# Altium project PCB_Project.PrjPcb
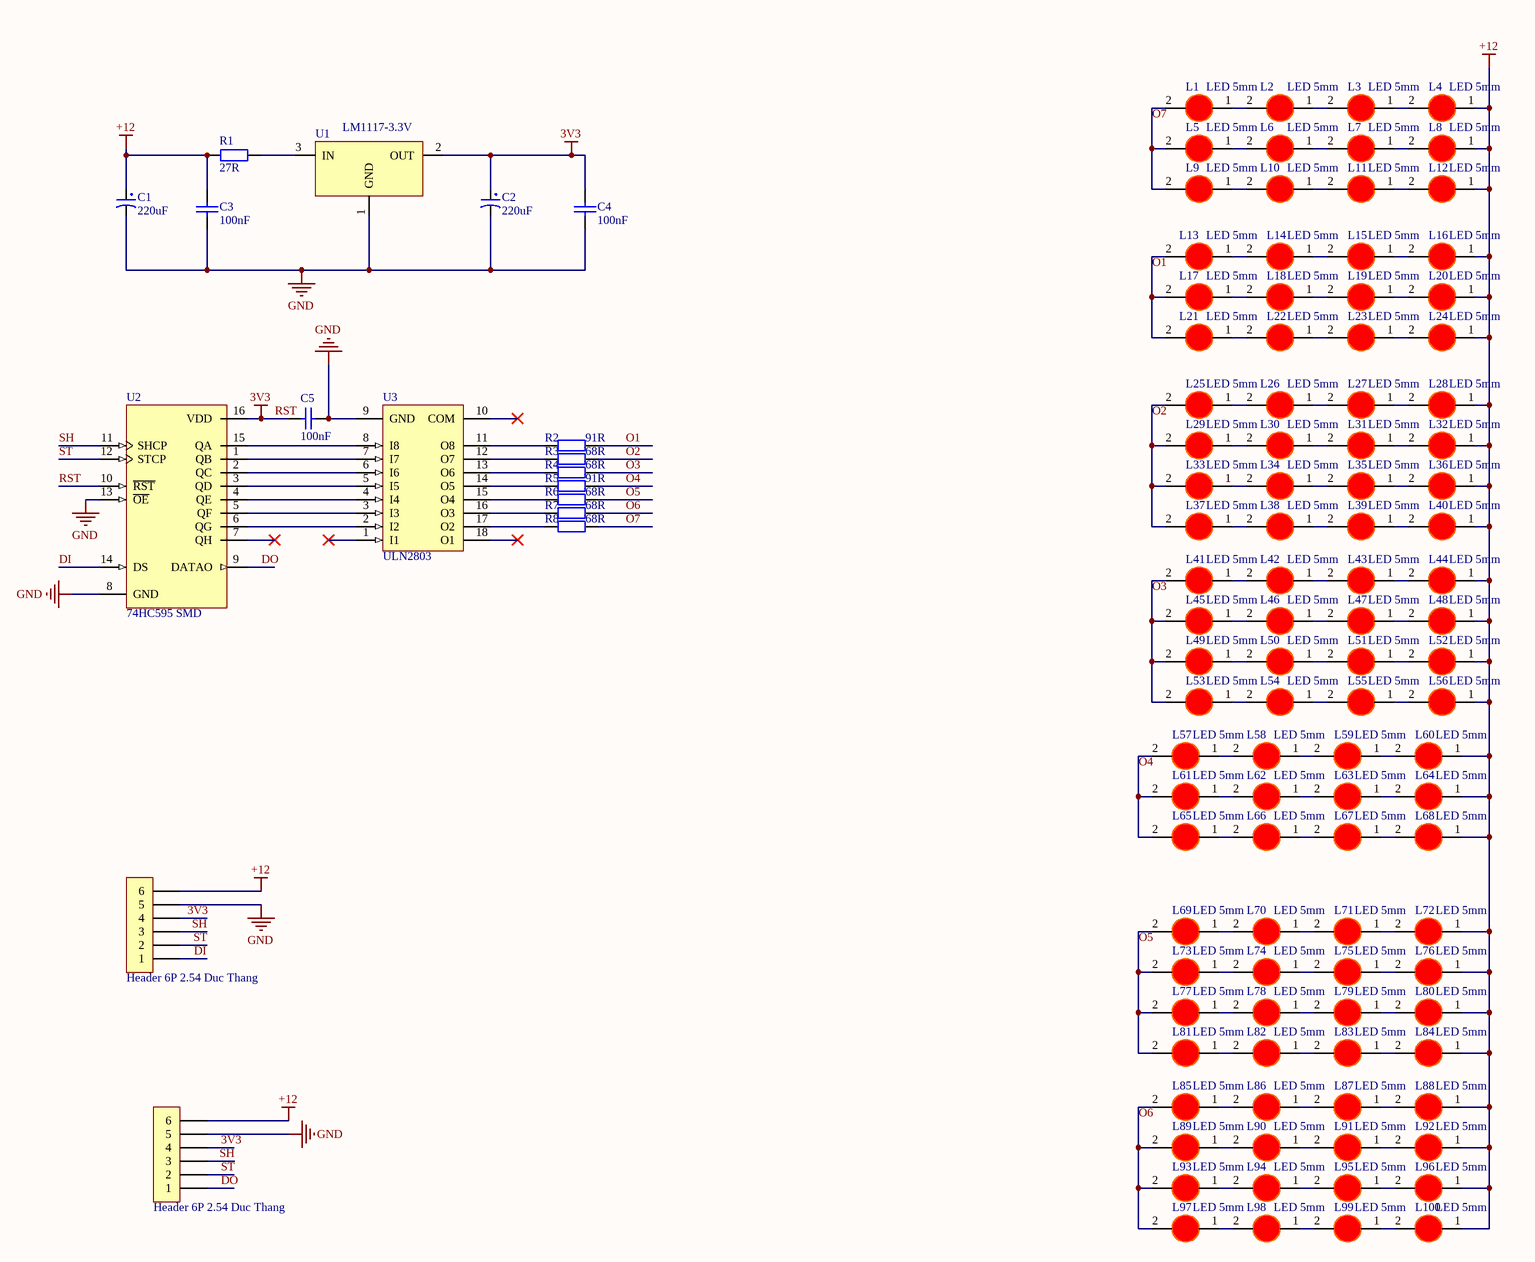
[diagram p0: Sheet1.SchDoc]
1 sheet, 118 parts. Net scope: global (net labels, ports and power ports of the same name join across sheets).
Board file: PCB2.PcbDoc

## Sheet Sheet1.SchDoc
size A3; SheetNumber: 1; SheetTotal: 1

### Parts
C1  220uF  [Tu hoa 5mm]
C2  220uF  [Tu hoa 5mm]
C3  100nF  [tu 0805]
C4  100nF  [tu 0805]
C5  100nF  [tu 0805]
H1  Header 6P 2.54 Duc Thang  [XH2.54M-6]
H2  Header 6P 2.54 Duc Thang  [XH2.54M-6]
L1  LED 5mm  [LED-5MM-RED]
L2  LED 5mm  [LED-5MM-RED]
L3  LED 5mm  [LED-5MM-RED]
L4  LED 5mm  [LED-5MM-RED]
L5  LED 5mm  [LED-5MM-RED]
L6  LED 5mm  [LED-5MM-RED]
L7  LED 5mm  [LED-5MM-RED]
L8  LED 5mm  [LED-5MM-RED]
L9  LED 5mm  [LED-5MM-RED]
L10  LED 5mm  [LED-5MM-RED]
L11  LED 5mm  [LED-5MM-RED]
L12  LED 5mm  [LED-5MM-RED]
L13  LED 5mm  [LED-5MM-RED]
L14  LED 5mm  [LED-5MM-RED]
L15  LED 5mm  [LED-5MM-RED]
L16  LED 5mm  [LED-5MM-RED]
L17  LED 5mm  [LED-5MM-RED]
L18  LED 5mm  [LED-5MM-RED]
L19  LED 5mm  [LED-5MM-RED]
L20  LED 5mm  [LED-5MM-RED]
L21  LED 5mm  [LED-5MM-RED]
L22  LED 5mm  [LED-5MM-RED]
L23  LED 5mm  [LED-5MM-RED]
L24  LED 5mm  [LED-5MM-RED]
L25  LED 5mm  [LED-5MM-RED]
L26  LED 5mm  [LED-5MM-RED]
L27  LED 5mm  [LED-5MM-RED]
L28  LED 5mm  [LED-5MM-RED]
L29  LED 5mm  [LED-5MM-RED]
L30  LED 5mm  [LED-5MM-RED]
L31  LED 5mm  [LED-5MM-RED]
L32  LED 5mm  [LED-5MM-RED]
L33  LED 5mm  [LED-5MM-RED]
L34  LED 5mm  [LED-5MM-RED]
L35  LED 5mm  [LED-5MM-RED]
L36  LED 5mm  [LED-5MM-RED]
L37  LED 5mm  [LED-5MM-RED]
L38  LED 5mm  [LED-5MM-RED]
L39  LED 5mm  [LED-5MM-RED]
L40  LED 5mm  [LED-5MM-RED]
L41  LED 5mm  [LED-5MM-RED]
L42  LED 5mm  [LED-5MM-RED]
L43  LED 5mm  [LED-5MM-RED]
L44  LED 5mm  [LED-5MM-RED]
L45  LED 5mm  [LED-5MM-RED]
L46  LED 5mm  [LED-5MM-RED]
L47  LED 5mm  [LED-5MM-RED]
L48  LED 5mm  [LED-5MM-RED]
L49  LED 5mm  [LED-5MM-RED]
L50  LED 5mm  [LED-5MM-RED]
L51  LED 5mm  [LED-5MM-RED]
L52  LED 5mm  [LED-5MM-RED]
L53  LED 5mm  [LED-5MM-RED]
L54  LED 5mm  [LED-5MM-RED]
L55  LED 5mm  [LED-5MM-RED]
L56  LED 5mm  [LED-5MM-RED]
L57  LED 5mm  [LED-5MM-RED]
L58  LED 5mm  [LED-5MM-RED]
L59  LED 5mm  [LED-5MM-RED]
L60  LED 5mm  [LED-5MM-RED]
L61  LED 5mm  [LED-5MM-RED]
L62  LED 5mm  [LED-5MM-RED]
L63  LED 5mm  [LED-5MM-RED]
L64  LED 5mm  [LED-5MM-RED]
L65  LED 5mm  [LED-5MM-RED]
L66  LED 5mm  [LED-5MM-RED]
L67  LED 5mm  [LED-5MM-RED]
L68  LED 5mm  [LED-5MM-RED]
L69  LED 5mm  [LED-5MM-RED]
L70  LED 5mm  [LED-5MM-RED]
L71  LED 5mm  [LED-5MM-RED]
L72  LED 5mm  [LED-5MM-RED]
L73  LED 5mm  [LED-5MM-RED]
L74  LED 5mm  [LED-5MM-RED]
L75  LED 5mm  [LED-5MM-RED]
L76  LED 5mm  [LED-5MM-RED]
L77  LED 5mm  [LED-5MM-RED]
L78  LED 5mm  [LED-5MM-RED]
L79  LED 5mm  [LED-5MM-RED]
L80  LED 5mm  [LED-5MM-RED]
L81  LED 5mm  [LED-5MM-RED]
L82  LED 5mm  [LED-5MM-RED]
L83  LED 5mm  [LED-5MM-RED]
L84  LED 5mm  [LED-5MM-RED]
L85  LED 5mm  [LED-5MM-RED]
L86  LED 5mm  [LED-5MM-RED]
L87  LED 5mm  [LED-5MM-RED]
L88  LED 5mm  [LED-5MM-RED]
L89  LED 5mm  [LED-5MM-RED]
L90  LED 5mm  [LED-5MM-RED]
L91  LED 5mm  [LED-5MM-RED]
L92  LED 5mm  [LED-5MM-RED]
L93  LED 5mm  [LED-5MM-RED]
L94  LED 5mm  [LED-5MM-RED]
L95  LED 5mm  [LED-5MM-RED]
L96  LED 5mm  [LED-5MM-RED]
L97  LED 5mm  [LED-5MM-RED]
L98  LED 5mm  [LED-5MM-RED]
L99  LED 5mm  [LED-5MM-RED]
L100  LED 5mm  [LED-5MM-RED]
R1  27R  [tro smd 1206]
R2  91R  [tro smd 1206]
R3  68R  [tro smd 1206]
R4  68R  [tro smd 1206]
R5  91R  [tro smd 1206]
R6  68R  [tro smd 1206]
R7  68R  [tro smd 1206]
R8  68R  [tro smd 1206]
U1  LM1117-3.3V  [SOT223]
U2  74HC595 SMD  [SOP 16]
U3  ULN2803  [SOP 18]

### Nets
3V3: C2.1 C4.1 C5.1 H1.4 H2.4 U1.2(OUT) U2.10(~{RST}) U2.16(VDD)  [also labelled RST]
+12: C1.1 C3.1 H1.6 H2.6 L4.1(A) L8.1(A) L12.1(A) L16.1(A) L20.1(A) L24.1(A) L28.1(A) L32.1(A) L36.1(A) L40.1(A) L44.1(A) L48.1(A) L52.1(A) L56.1(A) L60.1(A) L64.1(A) L68.1(A) L72.1(A) L76.1(A) L80.1(A) L84.1(A) L88.1(A) L92.1(A) L96.1(A) L100.1(A) R1.1
GND: C1.2 C2.2 C3.2 C4.2 C5.2 H1.5 H2.5 U1.1(GND) U2.8(GND) U2.13(~{OE}) U3.9(GND)
DI: H1.1 U2.14(DS)
DO: H2.1 U2.9(DATAO)
O1: L13.2(K) L17.2(K) L21.2(K) R2.2
O2: L25.2(K) L29.2(K) L33.2(K) L37.2(K) R3.2
O3: L41.2(K) L45.2(K) L49.2(K) L53.2(K) R4.2
O4: L57.2(K) L61.2(K) L65.2(K) R5.2
O5: L69.2(K) L73.2(K) L77.2(K) L81.2(K) R6.2
O6: L85.2(K) L89.2(K) L93.2(K) L97.2(K) R7.2
O7: L1.2(K) L5.2(K) L9.2(K) R8.2
SH: H1.3 H2.3 U2.11(SHCP)
ST: H1.2 H2.2 U2.12(STCP)
NetL1_1: L1.1(A) L2.2(K)
NetL2_1: L2.1(A) L3.2(K)
NetL3_1: L3.1(A) L4.2(K)
NetL5_1: L5.1(A) L6.2(K)
NetL6_1: L6.1(A) L7.2(K)
NetL7_1: L7.1(A) L8.2(K)
NetL9_1: L9.1(A) L10.2(K)
NetL10_1: L10.1(A) L11.2(K)
NetL11_1: L11.1(A) L12.2(K)
NetL13_1: L13.1(A) L14.2(K)
NetL14_1: L14.1(A) L15.2(K)
NetL15_1: L15.1(A) L16.2(K)
NetL17_1: L17.1(A) L18.2(K)
NetL18_1: L18.1(A) L19.2(K)
NetL19_1: L19.1(A) L20.2(K)
NetL21_1: L21.1(A) L22.2(K)
NetL22_1: L22.1(A) L23.2(K)
NetL23_1: L23.1(A) L24.2(K)
NetL25_1: L25.1(A) L26.2(K)
NetL26_1: L26.1(A) L27.2(K)
NetL27_1: L27.1(A) L28.2(K)
NetL29_1: L29.1(A) L30.2(K)
NetL30_1: L30.1(A) L31.2(K)
NetL31_1: L31.1(A) L32.2(K)
NetL33_1: L33.1(A) L34.2(K)
NetL34_1: L34.1(A) L35.2(K)
NetL35_1: L35.1(A) L36.2(K)
NetL37_1: L37.1(A) L38.2(K)
NetL38_1: L38.1(A) L39.2(K)
NetL39_1: L39.1(A) L40.2(K)
NetL41_1: L41.1(A) L42.2(K)
NetL42_1: L42.1(A) L43.2(K)
NetL43_1: L43.1(A) L44.2(K)
NetL45_1: L45.1(A) L46.2(K)
NetL46_1: L46.1(A) L47.2(K)
NetL47_1: L47.1(A) L48.2(K)
NetL49_1: L49.1(A) L50.2(K)
NetL50_1: L50.1(A) L51.2(K)
NetL51_1: L51.1(A) L52.2(K)
NetL53_1: L53.1(A) L54.2(K)
NetL54_1: L54.1(A) L55.2(K)
NetL55_1: L55.1(A) L56.2(K)
NetL57_1: L57.1(A) L58.2(K)
NetL58_1: L58.1(A) L59.2(K)
NetL59_1: L59.1(A) L60.2(K)
NetL61_1: L61.1(A) L62.2(K)
NetL62_1: L62.1(A) L63.2(K)
NetL63_1: L63.1(A) L64.2(K)
NetL65_1: L65.1(A) L66.2(K)
NetL66_1: L66.1(A) L67.2(K)
NetL67_1: L67.1(A) L68.2(K)
NetL69_1: L69.1(A) L70.2(K)
NetL70_1: L70.1(A) L71.2(K)
NetL71_1: L71.1(A) L72.2(K)
NetL73_1: L73.1(A) L74.2(K)
NetL74_1: L74.1(A) L75.2(K)
NetL75_1: L75.1(A) L76.2(K)
NetL77_1: L77.1(A) L78.2(K)
NetL78_1: L78.1(A) L79.2(K)
NetL79_1: L79.1(A) L80.2(K)
NetL81_1: L81.1(A) L82.2(K)
NetL82_1: L82.1(A) L83.2(K)
NetL83_1: L83.1(A) L84.2(K)
NetL85_1: L85.1(A) L86.2(K)
NetL86_1: L86.1(A) L87.2(K)
NetL87_1: L87.1(A) L88.2(K)
NetL89_1: L89.1(A) L90.2(K)
NetL90_1: L90.1(A) L91.2(K)
NetL91_1: L91.1(A) L92.2(K)
NetL93_1: L93.1(A) L94.2(K)
NetL94_1: L94.1(A) L95.2(K)
NetL95_1: L95.1(A) L96.2(K)
NetL97_1: L97.1(A) L98.2(K)
NetL98_1: L98.1(A) L99.2(K)
NetL99_1: L99.1(A) L100.2(K)
NetR1_2: R1.2 U1.3(IN)
NetR2_1: R2.1 U3.11(O8)
NetR3_1: R3.1 U3.12(O7)
NetR4_1: R4.1 U3.13(O6)
NetR5_1: R5.1 U3.14(O5)
NetR6_1: R6.1 U3.15(O4)
NetR7_1: R7.1 U3.16(O3)
NetR8_1: R8.1 U3.17(O2)
NetU2_1: U2.1(QB) U3.7(I7)
NetU2_2: U2.2(QC) U3.6(I6)
NetU2_3: U2.3(QD) U3.5(I5)
NetU2_4: U2.4(QE) U3.4(I4)
NetU2_5: U2.5(QF) U3.3(I3)
NetU2_6: U2.6(QG) U3.2(I2)
NetU2_15: U2.15(QA) U3.8(I8)

Not connected (* = marked no-connect by the designer): U2 7(QH)*; U3 1(I1)* 10(COM)* 18(O1)*

### Library data of the parts
C1 C2 = Tu Hoa 220uF 16V 6x11: Cắm; Don_Vi: Con; So_Chan: 2; Ten_Linh_Kien: Tụ Hóa 220uF 16V 6x11MM; Ma_Hang: MH001348; Chung_Loai: Cắm; Kieu_Chan: *
C3-C5 = Tu 0805 101 50V 20%: Dán; Don_Vi: Con; So_Chan: 2; Ten_Linh_Kien: Tụ 0805 101-0.1nF 50V 20%; Ma_Hang: MH002806; Chung_Loai: Dán; Kieu_Chan: *
H1 H2 = Header 6P 2.54 Duc Thang: Cắm; Ten_Linh_Kien: Header 6P XH2.54-6P Đực Thẳng; Don_Vi: Con; Ma_Hang: MH001972; Chung_Loai: Cắm
L1-L100 = LED 5mm Do: Cắm; Don_Vi: Con; Ma_Hang: MH008967; Ten_Linh_Kien: Led 5MM Phủ Đỏ (1000c); Ghi_Chu: *; Kieu_Chan: *; Chung_Loai: Cắm
R1 = Tro 1206 1% 10R: Dán; Don_Vi: Con; So_Chan: 2; Ten_Linh_Kien: Trở 1206 1% 10R; Ma_Hang: MH005886; Chung_Loai: Dán; Kieu_Chan: *
R2-R8 = Tro 1206 5% 1.5k: Dán; Don_Vi: Con; So_Chan: 2; Ten_Linh_Kien: Trở 1206 5% 1.5k; Ma_Hang: MH005903; Chung_Loai: Dán; Kieu_Chan: *
U1 = LM1117: 800mA Low-Dropout Linear Regulator; Creator: Nguyen Ba Bien; Website: http://group3i.net
U2 = 74HC595 SMD: Dán; Ten_Linh_Kien: 74HC595D SOP16; Don_Vi: Con; Ma_Hang: MH000672; Ghi_Chu: *; Kieu_Chan: *; Chung_Loai: Dán
U3 = ULN2803A SMD: Dán; Ten_Linh_Kien: ULN2803AG SOP18; Ma_Hang: MH002406; Don_Vi: Con; Ghi_Chu: *; Chung_Loai: Dán; Kieu_Chan: *